# Altium schematic sheet Sound_SCH.SchDoc
size A4; SheetNumber: 1; SheetTotal: 1
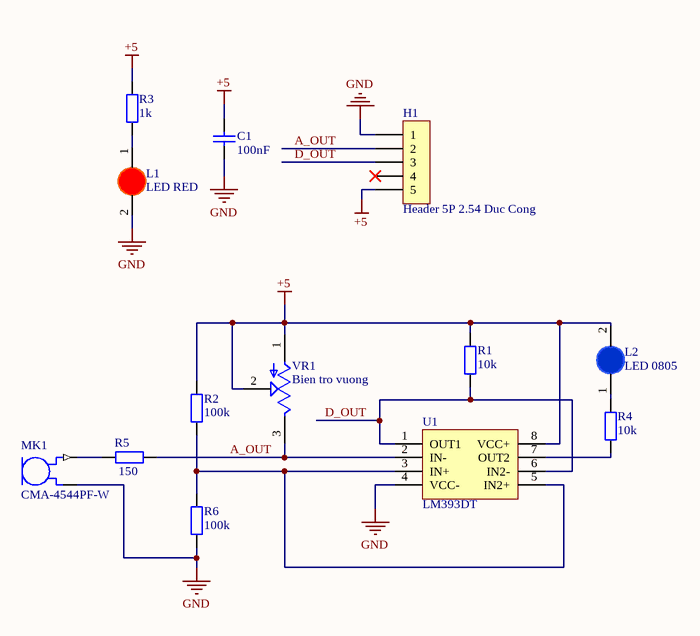
[diagram p0: Sound_SCH.SchDoc]

## Parts
C1  100nF  [tu 0603]
H1  Header 5P 2.54 Duc Cong  [Header 5P DC 2.54]
L1  LED RED  [LED-0805-Red]
L2  LED 0805  [LED-0805-Blue]
MK1  CMA-4544PF-W  [MIC_CMA-4544PF-W]
R1  10k  [tro smd 0603]
R2  100k  [tro smd 0603]
R3  1k  [tro smd 0603]
R4  10k  [tro smd 0603]
R5  150  [tro smd 0603]
R6  100k  [tro smd 0603]
U1  LM393DT  [SOIC8_50_328_25X90_SMT]
VR1  Bien tro vuong  [TRIM_3362P-1-102]

## Nets
+5: C1.1 H1.5 L2.2(K) R1.2 R2.2 R3.2 U1.8(VCC+) VR1.1(CCW) VR1.2(WIPER)
GND: C1.2 H1.1 L1.2(K) MK1.2(GND) R6.1 U1.4(VCC-)
A_OUT: H1.2 R5.2 U1.2(IN-) VR1.3(CW)
D_OUT: H1.3 R1.1 U1.1(OUT1) U1.6(IN2-)
NetL1_1: L1.1(A) R3.1
NetL2_1: L2.1(A) R4.2
NetMK1_1: MK1.1(OUT) R5.1
NetR2_1: R2.1 R6.2 U1.3(IN+) U1.5(IN2+)
NetR4_1: R4.1 U1.7(OUT2)

Not connected (* = marked no-connect by the designer): H1 4*

## Library data of the parts
C1 = Tu 0603 104 50V 10%: Dán; Don_Vi: Con; So_Chan: 2; Ten_Linh_Kien: Tụ 0603 104-100nF 10% 50V; Ma_Hang: MH004568; Chung_Loai: Dán; Kieu_Chan: *
H1 = Header 5P 2.54 Duc Cong: Cắm; Ten_Linh_Kien: Header 5P XH2.54-5P Đực Cong; Don_Vi: Con; Ma_Hang: MH001308; Chung_Loai: Cắm
L1 = LED 0805 Do: Dán; Don_Vi: Con; Ma_Hang: MH000897; Ten_Linh_Kien: LED 0805 Màu Đỏ (Red); Ghi_Chu: *; Kieu_Chan: *; Chung_Loai: Dán
L2 = LED 0805 Xanh Duong: Dán; Don_Vi: Con; Ma_Hang: MH002327; Ten_Linh_Kien: LED 0805 Màu Xanh Dương (Blue); Ghi_Chu: *; Kieu_Chan: *; Chung_Loai: Dán
MK1 = CMA-4544PF-W: 9.7 mm, Omnidirectional, PCB Mount, 3.0 Vdc, Electret Condenser Microphone; MF: Same Sky; SnapEDA_Link: https://www.snapeda.com/parts/CMA-4544PF-W/Same+Sky/view-part/?ref=snap; Package: None; Value: *; MP: CMA-4544PF-W; Check_prices: https://www.snapeda.com/parts/CMA-4544PF-W/Same+Sky/view-part/?ref=eda
R1 R2 R4 R6 = Tro 0603 5% 100k: Dán; So_Chan: 2; Ten_Linh_Kien: Trở 0603 5% 100k; Ma_Hang: MH006314; Don_Vi: Con; Chung_Loai: Dán; Kieu_Chan: *
R3 = Tro 0603 1% 1k: Dán; So_Chan: 2; Don_Vi: Con; Ten_Linh_Kien: Trở 0603 1% 1k; Ma_Hang: MH006334; Chung_Loai: Dán; Kieu_Chan: *
R5 = Tro 0603 5% 150R: Dán; Don_Vi: Con; So_Chan: 2; Ten_Linh_Kien: Trở 0603 5% 150R; Ma_Hang: MH006318; Chung_Loai: Dán; Kieu_Chan: *
U1 = IC_LM393DT: Comparator General Purpose CMOS, DTL, ECL, MOS, Open-Collector, TTL 8-SO; Manufacturer: Texas Instruments; Alternate Part Number-1: NA; Manufacturer Part Number: LM393DT; Case/Package: SOIC8; Supplier-1: ARROW; Supplier Part Number-1: LM393DT
VR1 = Bien tro vuong: TRIMMER - 1/4in SQ ST CERMET | Bourns 3362P-1-102; SnapEDA_Link: https://www.snapeda.com/parts/3362P-1-102/Bourns/view-part/?ref=snap; Package: 3362P-1 Bourns Inc.; Value: *; MF: Bourns; MP: 3362P-1-102; Check_prices: https://www.snapeda.com/parts/3362P-1-102/Bourns/view-part/?ref=eda